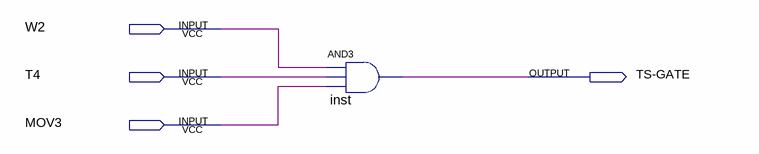
[diagram p0: schematic sheet]
// Quartus schematic TSG.bdf as structural Verilog: 1 symbols, 4 pins
module TSG (
  input  W2,
  input  T4,
  input  MOV3,
  output \TS-GATE 
);

  and inst (\TS-GATE , W2, T4, MOV3);
endmodule
